# EAGLE design pressure-sensor-mux (EAGLE 9.7.0)
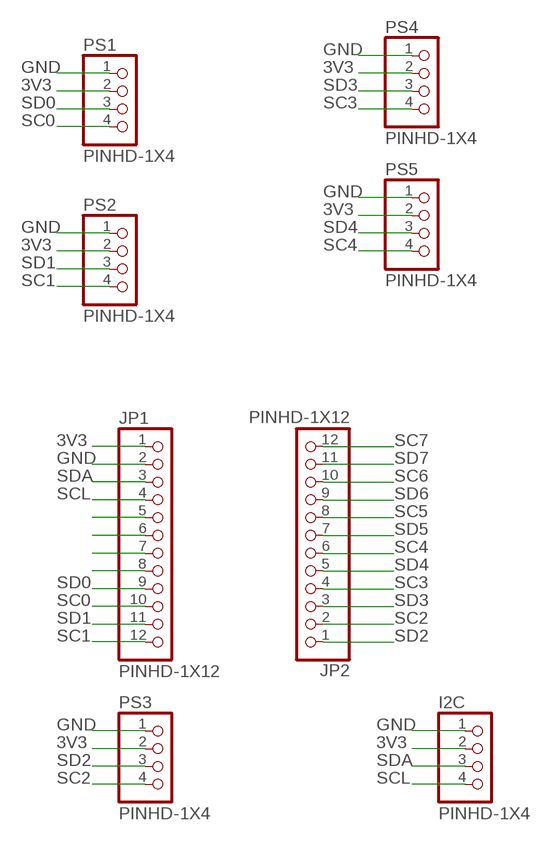
[diagram p0: schematic, sheet 1]

## Parts
I2C  PINHD-1X4  [1X04]
JP1  PINHD-1X12  [1X12]
JP2  PINHD-1X12  [1X12]
PS1  PINHD-1X4  [1X04]
PS2  PINHD-1X4  [1X04]
PS3  PINHD-1X4  [1X04]
PS4  PINHD-1X4  [1X04]
PS5  PINHD-1X4  [1X04]

## Nets
3V3: I2C.2 JP1.1 PS1.2 PS2.2 PS3.2 PS4.2 PS5.2
GND: I2C.1 JP1.2 PS1.1 PS2.1 PS3.1 PS4.1 PS5.1
N$5: JP1.5
N$6: JP1.6
N$7: JP1.7
N$8: JP1.8
SC0: JP1.10 PS1.4
SC1: JP1.12 PS2.4
SC2: JP2.2 PS3.4
SC3: JP2.4 PS4.4
SC4: JP2.6 PS5.4
SC5: JP2.8
SC6: JP2.10
SC7: JP2.12
SCL: I2C.4 JP1.4
SD0: JP1.9 PS1.3
SD1: JP1.11 PS2.3
SD2: JP2.1 PS3.3
SD3: JP2.3 PS4.3
SD4: JP2.5 PS5.3
SD5: JP2.7
SD6: JP2.9
SD7: JP2.11
SDA: I2C.3 JP1.3

## Library data of the parts
I2C = Connector:PINHD-1X4: PIN HEADER; CATEGORY: CONNECTOR; SUB-CATEGORY: PIN-HEADER
JP1 JP2 = pressure sensor footprint:PINHD-1X12: PIN HEADER; CATEGORY: CONNECTOR; SUB-CATEGORY: PIN-HEADER
PS1-PS5 = pressure sensor footprint:PINHD-1X4: PIN HEADER; CATEGORY: CONNECTOR; SUB-CATEGORY: PIN-HEADER

## Board
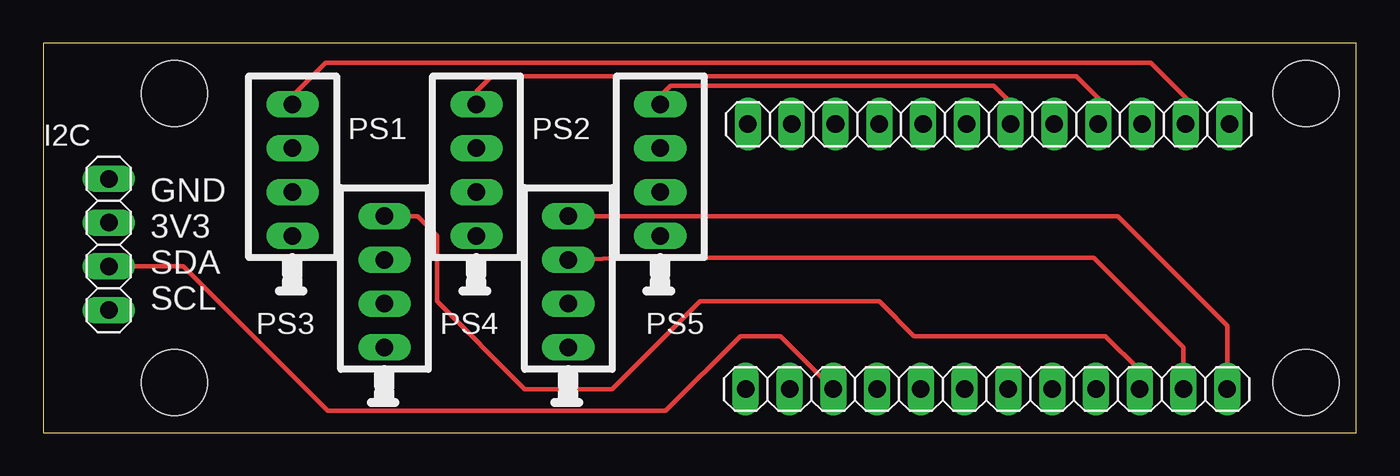
[diagram p1: board, top side]
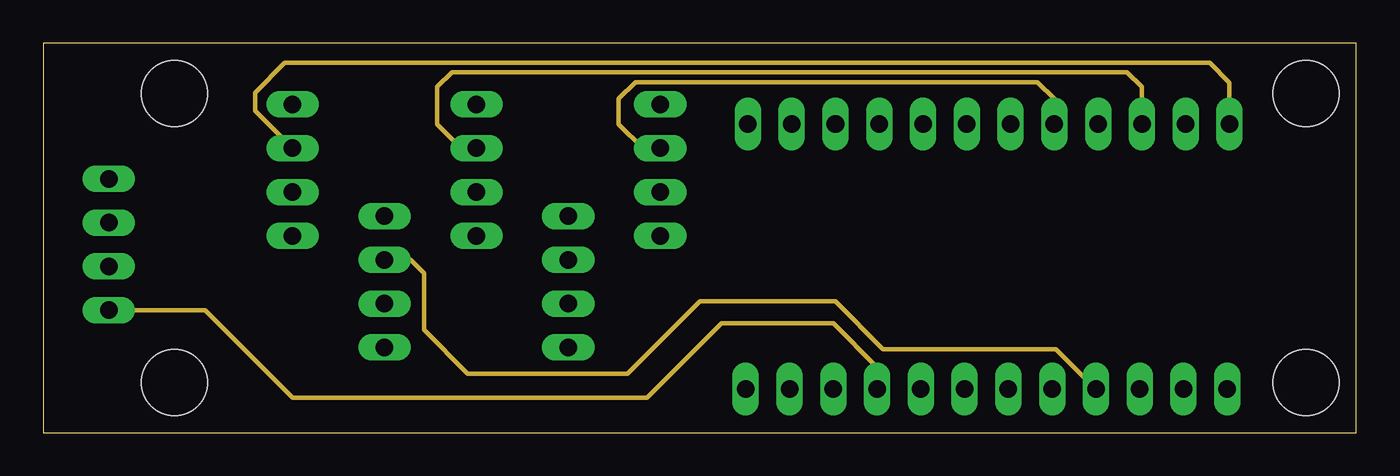
[diagram p2: board, inner layer Route2]
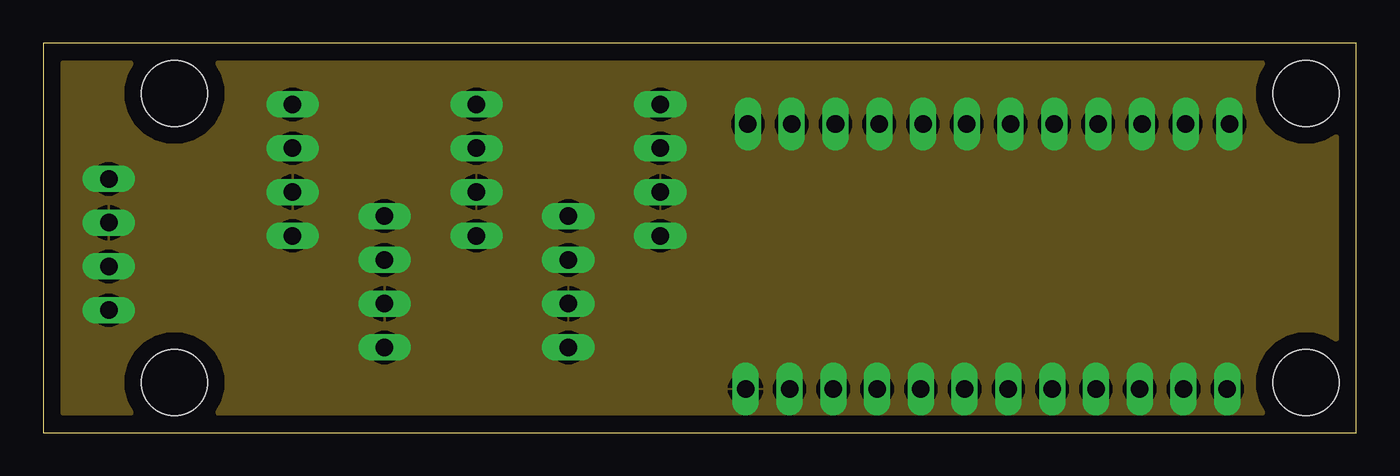
[diagram p3: board, inner layer Route15]
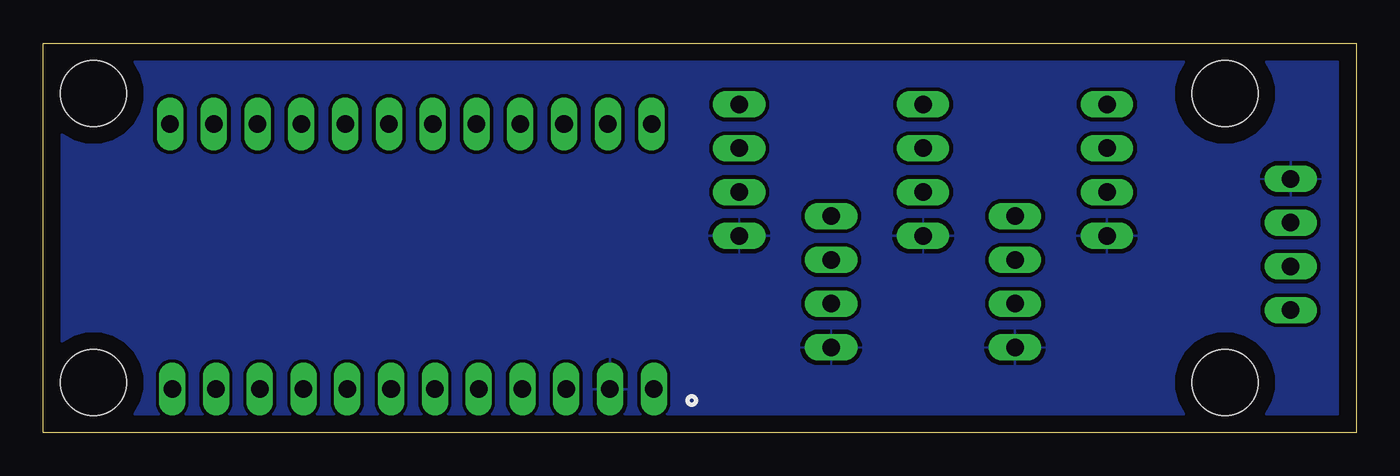
[diagram p4: board, bottom side, seen from below]

Size 76.2 x 22.61 mm. Coordinates in mm from the lower left corner, seen from the top.
Outline: 0,0 76.2,0 76.2,22.61 0,22.61 0,0
Copper layers (1+2*15+16): Top / Route2 / Route15 / Bottom
Stack-up 4 Layer Stack: Top SilkScreen Epoxy Ink / Top SolderMask SR:Green 0.0254mm Dk 4.3 / Top Surface Finish Lead-Free 0.02mm / Top CuFoil:007 0.035mm / Dielectric-1 Prepreg:001 0.064mm / Dielectric-2 Prepreg:001 0.064mm / Route2 CuFoil:007 0.035mm / Dielectric-3 Core:066 0.711mm / Route15 CuFoil:007 0.035mm / Dielectric-4 Prepreg:001 0.064mm / Dielectric-5 Prepreg:001 0.064mm / Bottom CuFoil:007 0.035mm / Bottom Surface Finish Lead-Free 0.02mm / Bottom SolderMask SR:Green 0.0254mm Dk 4.3 / Bottom SilkScreen Epoxy Ink
Design rules "default *": minimum track width 6mil, minimum drill 0.35mm, track to track 6mil, track to pad 6mil, pad to pad 6mil, via to via 6mil, smd to smd 6mil, copper to edge 40mil, drill to drill 6mil, minimum pad ring 10mil, minimum via ring 8mil, stop-mask expansion 4mil, vias tented up to drill 0mil, thermal gap 10mil
Holes 3.81 mm at 7.62,2.92 7.62,19.68 73.28,19.68 73.28,2.92

### Footprints (pad centres in the part's own frame; a part is rotated, then mirrored left to right if it is on the bottom)
1X04 = drill 1.016 long: 1 -3.81,0; 2 -1.27,0; 3 1.27,0; 4 3.81,0
1X12 = drill 1.016 long: 1 -13.97,0; 2 -11.43,0; 3 -8.89,0; 4 -6.35,0; 5 -3.81,0; 6 -1.27,0; 7 1.27,0; 8 3.81,0; 9 6.35,0; 10 8.89,0; 11 11.43,0; 12 13.97,0

### Placement (x,y rotation side)
I2C  3.81,10.92 270 top
JP1  54.74,2.54 0 top
JP2  54.86,17.91 180 top
PS1  19.81,8.76 90 top
PS2  30.48,8.76 90 top
PS3  14.48,15.24 90 top
PS4  25.15,15.24 90 top
PS5  35.81,15.24 90 top

### Tracks (layer width: path | path; a pad name or v marks a point on that pad's centre or on a via)
3V3
  pour Route15 (isolate 0.203): -2.54,-6.35 -2.54,24.13 78.74,24.13 78.74,-6.35
GND
  pour Bottom (isolate 0.203): -1.27,22.86 77.47,22.86 77.47,-5.08 -1.27,-5.08
SC0
  Top 0.254: PS1.4 21.72,12.57 22.86,11.43 22.86,7.62 27.94,2.54 33.02,2.54 38.1,7.62 48.51,7.62 50.52,5.61 61.65,5.61 63.63,3.63 JP1.10
SC1
  Top 0.254: PS2.4 62.36,12.57 68.71,6.22 JP1.12
SC2
  Top 0.254: JP2.2 66.29,19.43 64.26,21.46 16.38,21.46 14.56,19.64 PS3.4
SC3
  Top 0.254: JP2.4 61.21,19.41 59.94,20.68 26.01,20.68 25.15,19.81 PS4.4
SC4
  Top 0.254: JP2.6 56.13,19.18 55.17,20.14 36.4,20.14 35.81,19.56 PS5.4
SCL
  Route2 0.254: I2C.4 9.4,7.11 14.48,2.03 35.05,2.03 39.37,6.35 45.85,6.35 48.39,3.81 JP1.4
SD0
  Route2 0.254: PS1.3 21.34,10.03 22.1,9.27 22.1,5.97 24.64,3.43 33.91,3.43 38.1,7.62 45.97,7.62 48.74,4.85 58.78,4.85 JP1.9
SD1
  Top 0.254: PS2.3 34.42,10.16 60.96,10.16 66.17,4.95 JP1.11
SD2
  Route2 0.254: JP2.1 68.83,20.32 67.69,21.46 14.02,21.46 12.29,19.73 12.29,18.69 PS3.3
SD3
  Route2 0.254: JP2.3 63.75,20.07 62.89,20.93 23.72,20.93 22.86,20.07 22.86,17.91 24.26,16.51 PS4.3
SD4
  Route2 0.254: JP2.5 58.67,19.36 57.69,20.34 34.37,20.34 33.4,19.38 33.4,17.91 34.8,16.51 PS5.3
SDA
  Top 0.254: I2C.3 8.13,9.65 16.51,1.27 36.12,1.27 40.46,5.61 42.77,5.61 JP1.3

### Text on the board
tPlace: GND / 3V3 / SDA / SCL